# Altium schematic sheet BitDogLab V7.SchDoc: BitDogLab
size 420 x 297 mm; CompanyName: Escola 4.0 - Prof. Fruett; DrawnBy: Bruno Battistella; Revision: V7; SheetNumber: 1; SheetTotal: 1; SPICEModelCacheZKALFPLI: <root> / <DocumentId>ZKALFPLI</DocumentId> / </root>
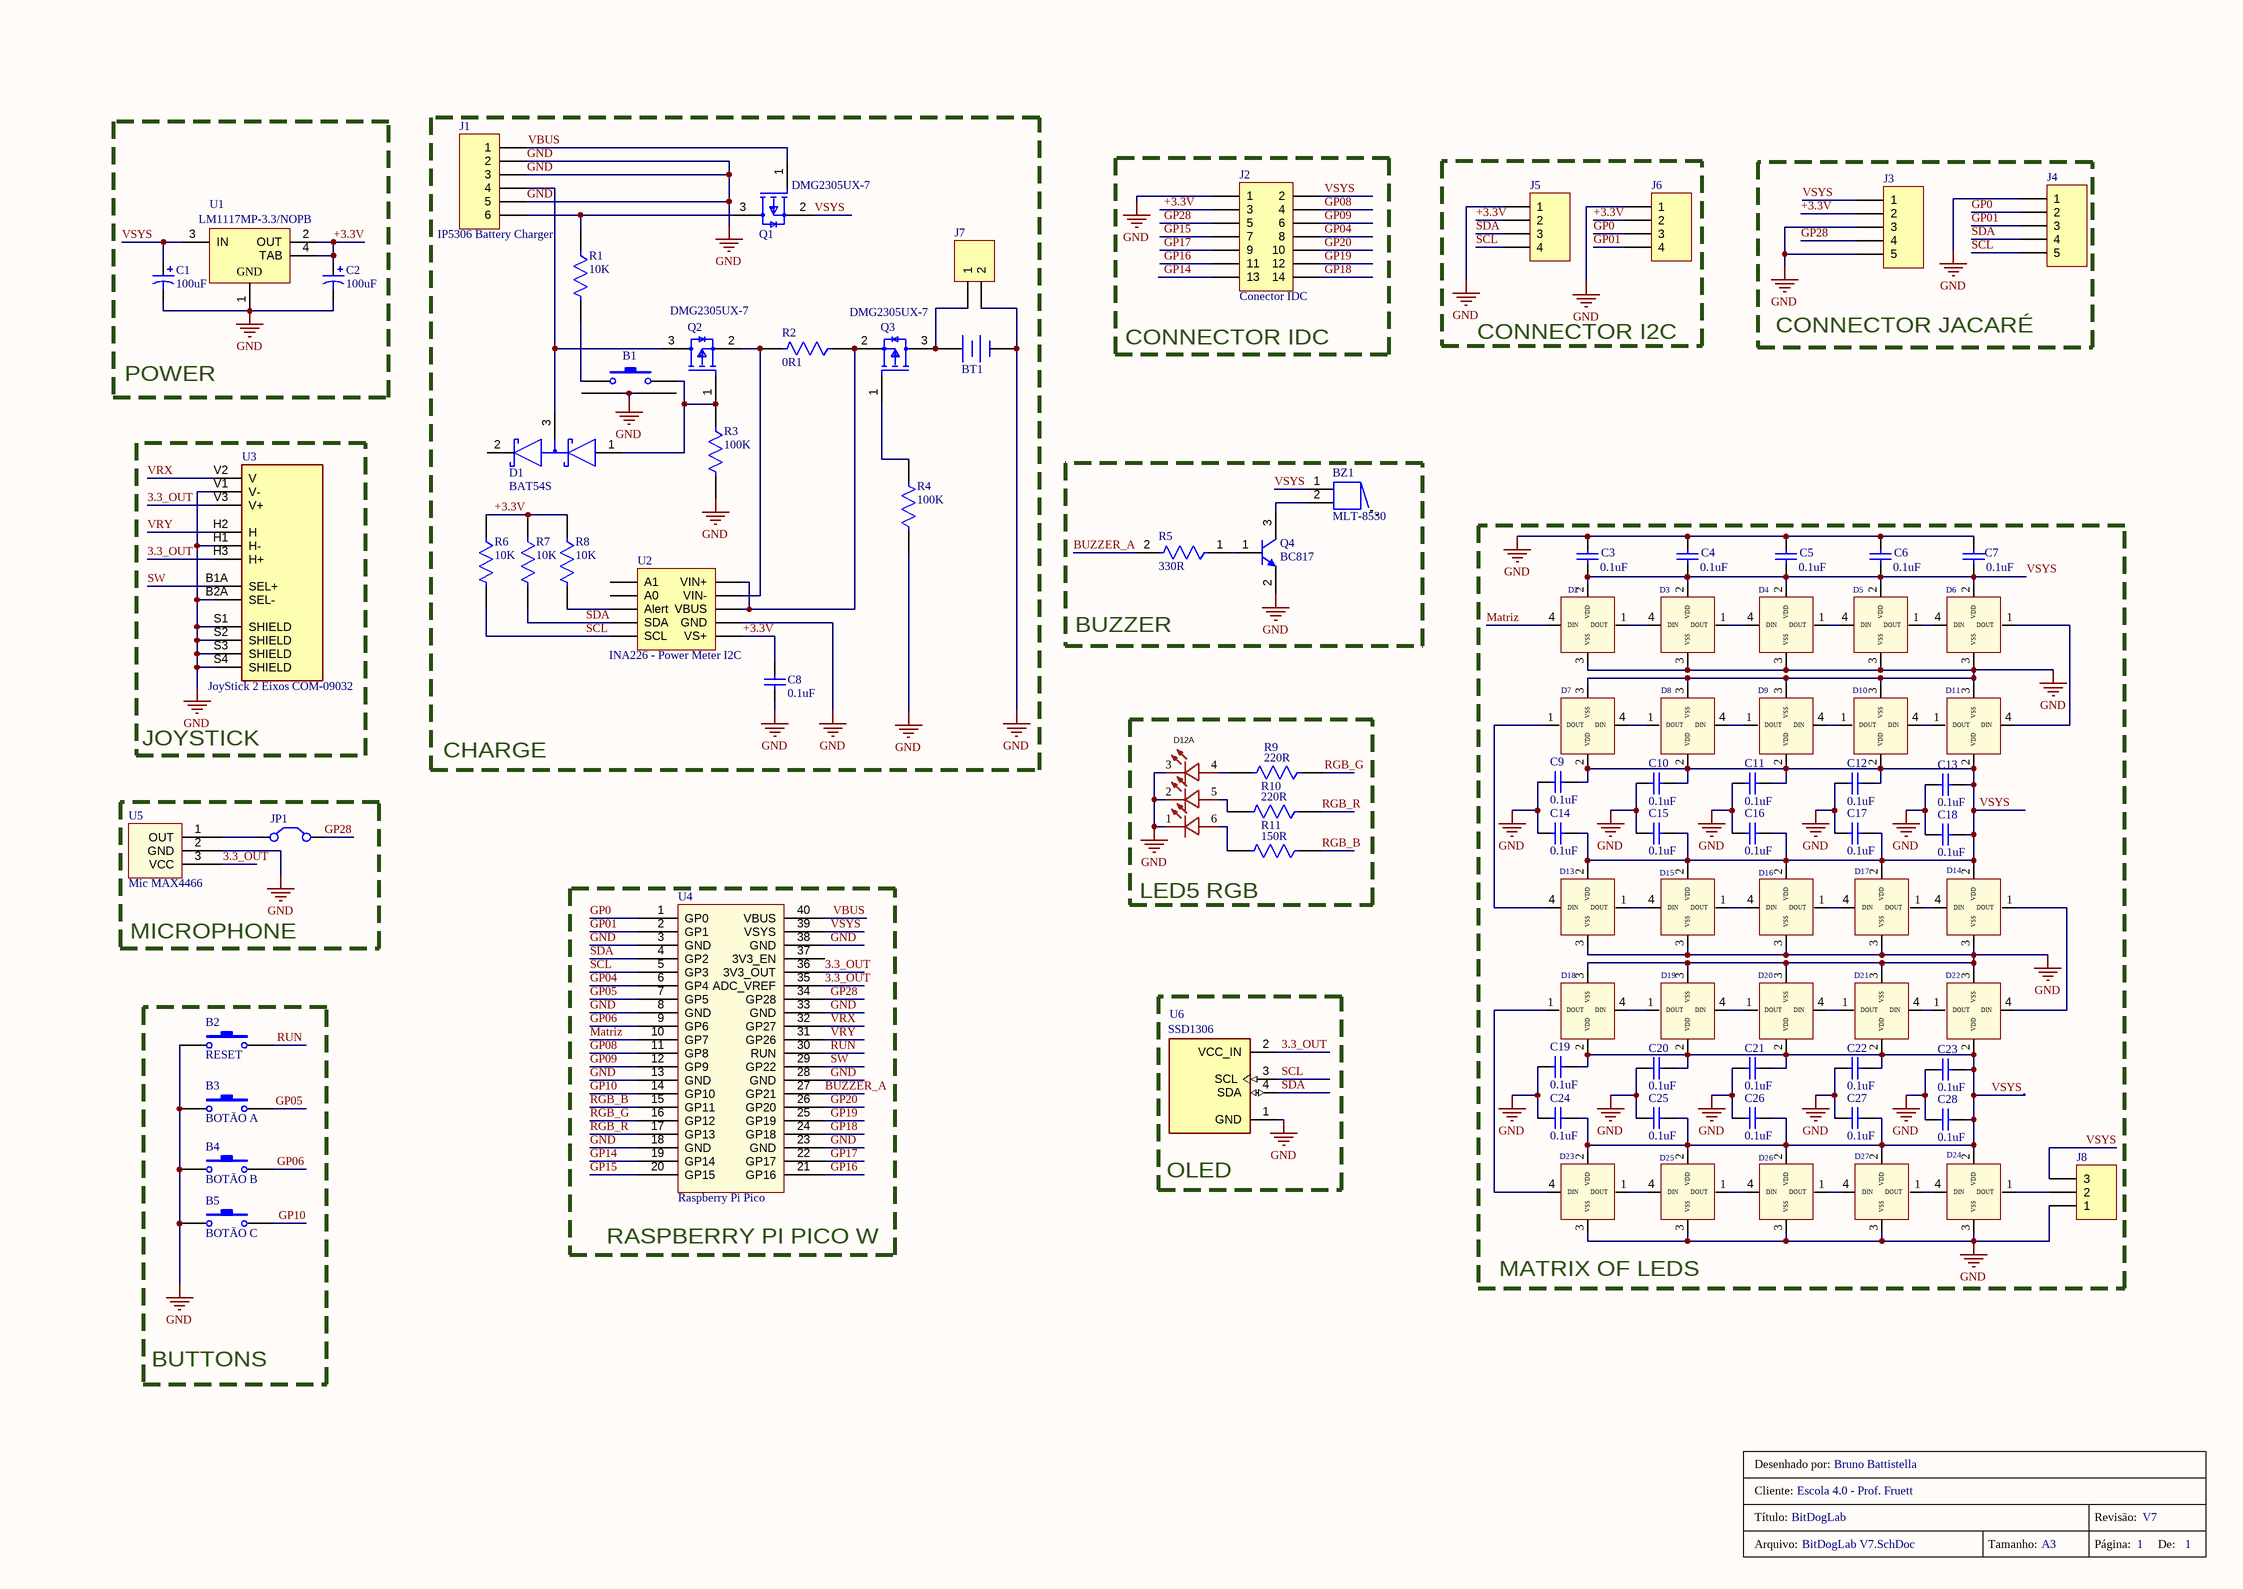
[diagram p0: BitDogLab V7.SchDoc]

## Parts
B1  Desliga  [CHAVE TÁCTIL SMD 90]  (value not drawn)
B2  RESET  [CHAVE TÁCTIL SMD]
B3  BOTÃO A  [CHAVE TÁCTIL 12mm - SMD]
B4  BOTÃO B  [CHAVE TÁCTIL 12mm - SMD]
B5  BOTÃO C  [CHAVE TÁCTIL 12mm - SMD]
BT1  FP-1043P-MFG  [Bateria 18650 - SMD]  (value not drawn)
BZ1  MLT-8530  [Buzzer SMD - MLT-8530]
C1  value 100uF  [Capacitor SMD - 6.3 x 5.4mm]  (hidden comment: Capacitor Eletrolítico SMD,D6.3xL5.4mm)
C2  value 100uF  [Capacitor SMD - 6.3 x 5.4mm]  (hidden comment: Capacitor Eletrolítico SMD,D6.3xL5.4mm)
C3  value 0.1uF  [Capacitor SMD 0402]  (hidden comment: Cap)
C4  value 0.1uF  [Capacitor SMD 0402]  (hidden comment: Cap)
C5  value 0.1uF  [Capacitor SMD 0402]  (hidden comment: Cap)
C6  value 0.1uF  [Capacitor SMD 0402]  (hidden comment: Cap)
C7  value 0.1uF  [Capacitor SMD 0402]  (hidden comment: Cap)
C8  value 0.1uF  [Capacitor SMD 0603]  (hidden comment: Cap)
C9  value 0.1uF  [Capacitor SMD 0402]  (hidden comment: Cap)
C10  value 0.1uF  [Capacitor SMD 0402]  (hidden comment: Cap)
C11  value 0.1uF  [Capacitor SMD 0402]  (hidden comment: Cap)
C12  value 0.1uF  [Capacitor SMD 0402]  (hidden comment: Cap)
C13  value 0.1uF  [Capacitor SMD 0402]  (hidden comment: Cap)
C14  value 0.1uF  [Capacitor SMD 0402]  (hidden comment: Cap)
C15  value 0.1uF  [Capacitor SMD 0402]  (hidden comment: Cap)
C16  value 0.1uF  [Capacitor SMD 0402]  (hidden comment: Cap)
C17  value 0.1uF  [Capacitor SMD 0402]  (hidden comment: Cap)
C18  value 0.1uF  [Capacitor SMD 0402]  (hidden comment: Cap)
C19  value 0.1uF  [Capacitor SMD 0402]  (hidden comment: Cap)
C20  value 0.1uF  [Capacitor SMD 0402]  (hidden comment: Cap)
C21  value 0.1uF  [Capacitor SMD 0402]  (hidden comment: Cap)
C22  value 0.1uF  [Capacitor SMD 0402]  (hidden comment: Cap)
C23  value 0.1uF  [Capacitor SMD 0402]  (hidden comment: Cap)
C24  value 0.1uF  [Capacitor SMD 0402]  (hidden comment: Cap)
C25  value 0.1uF  [Capacitor SMD 0402]  (hidden comment: Cap)
C26  value 0.1uF  [Capacitor SMD 0402]  (hidden comment: Cap)
C27  value 0.1uF  [Capacitor SMD 0402]  (hidden comment: Cap)
C28  value 0.1uF  [Capacitor SMD 0402]  (hidden comment: Cap)
D1  BAT54S  [FP-6_541-5014_01-4-MFG]
D2  XINGLIGHT XL-1615RGBC-WS2812B  [LED RGB - XL-1615RGBC-WS2812B]  (value not drawn)
D3  XINGLIGHT XL-1615RGBC-WS2812B  [LED RGB - XL-1615RGBC-WS2812B]  (value not drawn)
D4  XINGLIGHT XL-1615RGBC-WS2812B  [LED RGB - XL-1615RGBC-WS2812B]  (value not drawn)
D5  XINGLIGHT XL-1615RGBC-WS2812B  [LED RGB - XL-1615RGBC-WS2812B]  (value not drawn)
D6  XINGLIGHT XL-1615RGBC-WS2812B  [LED RGB - XL-1615RGBC-WS2812B]  (value not drawn)
D7  XINGLIGHT XL-1615RGBC-WS2812B  [LED RGB - XL-1615RGBC-WS2812B]  (value not drawn)
D8  XINGLIGHT XL-1615RGBC-WS2812B  [LED RGB - XL-1615RGBC-WS2812B]  (value not drawn)
D9  XINGLIGHT XL-1615RGBC-WS2812B  [LED RGB - XL-1615RGBC-WS2812B]  (value not drawn)
D10  XINGLIGHT XL-1615RGBC-WS2812B  [LED RGB - XL-1615RGBC-WS2812B]  (value not drawn)
D11  XINGLIGHT XL-1615RGBC-WS2812B  [LED RGB - XL-1615RGBC-WS2812B]  (value not drawn)
D12  HL-AF-5060H271BU46FU79GC-S1-THL  [LED RGB SMD 5050]  (value not drawn)  (part A of 3)
D13  XINGLIGHT XL-1615RGBC-WS2812B  [LED RGB - XL-1615RGBC-WS2812B]  (value not drawn)
D14  XINGLIGHT XL-1615RGBC-WS2812B  [LED RGB - XL-1615RGBC-WS2812B]  (value not drawn)
D15  XINGLIGHT XL-1615RGBC-WS2812B  [LED RGB - XL-1615RGBC-WS2812B]  (value not drawn)
D16  XINGLIGHT XL-1615RGBC-WS2812B  [LED RGB - XL-1615RGBC-WS2812B]  (value not drawn)
D17  XINGLIGHT XL-1615RGBC-WS2812B  [LED RGB - XL-1615RGBC-WS2812B]  (value not drawn)
D18  XINGLIGHT XL-1615RGBC-WS2812B  [LED RGB - XL-1615RGBC-WS2812B]  (value not drawn)
D19  XINGLIGHT XL-1615RGBC-WS2812B  [LED RGB - XL-1615RGBC-WS2812B]  (value not drawn)
D20  XINGLIGHT XL-1615RGBC-WS2812B  [LED RGB - XL-1615RGBC-WS2812B]  (value not drawn)
D21  XINGLIGHT XL-1615RGBC-WS2812B  [LED RGB - XL-1615RGBC-WS2812B]  (value not drawn)
D22  XINGLIGHT XL-1615RGBC-WS2812B  [LED RGB - XL-1615RGBC-WS2812B]  (value not drawn)
D23  XINGLIGHT XL-1615RGBC-WS2812B  [LED RGB - XL-1615RGBC-WS2812B]  (value not drawn)
D24  XINGLIGHT XL-1615RGBC-WS2812B  [LED RGB - XL-1615RGBC-WS2812B]  (value not drawn)
D25  XINGLIGHT XL-1615RGBC-WS2812B  [LED RGB - XL-1615RGBC-WS2812B]  (value not drawn)
D26  XINGLIGHT XL-1615RGBC-WS2812B  [LED RGB - XL-1615RGBC-WS2812B]  (value not drawn)
D27  XINGLIGHT XL-1615RGBC-WS2812B  [LED RGB - XL-1615RGBC-WS2812B]  (value not drawn)
J1  IP5306 Battery Charger  [Charger Module IP5306]
J2  Conector IDC  [Conector IDC 14 Pinos]
J3  Header 5  [HDR1X5]  (value not drawn)
J4  Header 5  [HDR1X5]  (value not drawn)
J5  Header 4  [Connector XH 1x4]  (value not drawn)
J6  Header 4  [Connector XH 1x4]  (value not drawn)
J7  KRE  [HDR1X2 3D Macho]  (value not drawn)
J8  Header 3  [HDR1x3 3D Macho]  (value not drawn)
JP1  Jumper  [HDR1x3 3D Macho]  (value not drawn)
Q1  DMG2305UX-7  [FP-SOT23-IPC_B]
Q2  DMG2305UX-7  [FP-SOT23-IPC_B]
Q3  DMG2305UX-7  [FP-SOT23-IPC_B]
Q4  BC817  [ONSC-SOT-23-3-318-08_V]
R1  10K  [FP-CRCW0603-e3-IPC_C]
R2  0R1  [FP-RL2512-MFG]
R3  100K  [FP-CRCW0603-e3-IPC_C]
R4  100K  [FP-CRCW0603-e3-IPC_C]
R5  330R  [FP-CRCW0603-e3-IPC_C]
R6  10K  [FP-CRCW0603-e3-IPC_C]
R7  10K  [FP-CRCW0603-e3-IPC_C]
R8  10K  [FP-CRCW0603-e3-IPC_C]
R9  220R  [FP-CRCW0603-e3-IPC_C]
R10  220R  [FP-CRCW0603-e3-IPC_C]
R11  150R  [FP-CRCW0603-e3-IPC_C]
U1  LM1117MP-3.3/NOPB  [DCY0004A_L]
U2  INA226 - Power Meter I2C  [MSOP 10 Pinos]
U3  JoyStick 2 Eixos COM-09032  [JoyStick PCB - PS5 3.0]
U4  Raspberry Pi Pico  [Raspberry Pi Pico W - Header SMD Tipo 1 e 2]
U5  Mic MAX4466  [MAX4466]
U6  SSD1306  [DISPLAY OLED 128x128 e 128x64]

## Blocks framed on the sheet
POWER: C1 C2 U1
CHARGE: B1 BT1 C8 D1 J1 J7 Q1-Q3 R1-R4 R6-R8 U2
CONNECTOR IDC: J2
CONNECTOR I2C: J5 J6
CONNECTOR JACARÉ: J3 J4
JOYSTICK: U3
BUZZER: BZ1 Q4 R5
MATRIX OF LEDS: C3-C7 C9-C28 D2-D11 D13-D27 J8
LED5 RGB: D12 R9-R11
MICROPHONE: JP1 U5
RASPBERRY PI PICO W: U4
BUTTONS: B2-B5
OLED: U6

## Nets
GND: B1.3 B1.4 B2.1 B3.1 B4.1 B5.1 BT1.1(-) C1.2 C2.2 C3.2 C4.2 C5.2 C6.2 C7.2 C8.2 C9.2 C10.2 C11.2 C12.2 C13.2 C14.2 C15.2 C16.2 C17.2 C18.2 C19.2 C20.2 C21.2 C22.2 C23.2 C24.2 C25.2 C26.2 C27.2 C28.2 D2.3(VSS) D3.3(VSS) D4.3(VSS) D5.3(VSS) D6.3(VSS) D7.3(VSS) D8.3(VSS) D9.3(VSS) D10.3(VSS) D11.3(VSS) D12.1 D12.2 D12.3 D13.3(VSS) D14.3(VSS) D15.3(VSS) D16.3(VSS) D17.3(VSS) D18.3(VSS) D19.3(VSS) D20.3(VSS) D21.3(VSS) D22.3(VSS) D23.3(VSS) D24.3(VSS) D25.3(VSS) D26.3(VSS) D27.3(VSS) J1.2 J1.3 J1.5 J2.1 J3.3 J3.5 J4.1 J5.1 J6.1 J7.2 J8.1 Q4.2(E) R3.2 R4.1 U1.1(GND) U2.7(GND) U3.B2A(SEL-) U3.H1(H-) U3.S1(SHIELD) U3.S2(SHIELD) U3.S3(SHIELD) U3.S4(SHIELD) U3.V1(V-) U4.3(GND) U4.8(GND) U4.13(GND) U4.18(GND) U4.23(GND) U4.28(GND) U4.33(GND) U4.38(GND) U5.2(GND) U6.1(GND)
3.3_OUT: U3.H3(H+) U3.V3(V+) U4.35(ADC_VREF) U4.36(3V3_OUT) U5.3(VCC) U6.2(VCC_IN)
+3.3V: C2.1 C8.1 J2.3 J3.2 J5.2 J6.2 R6.1 R7.1 R8.1 U1.2(OUT) U1.4(TAB) U2.6(VS+)
BUZZER_A: R5.2 U4.27(GP21)
GP0: J4.2 J6.3 U4.1(GP0)
GP01: J4.3 J6.4 U4.2(GP1)
GP04: J2.8 U4.6(GP4)
GP05: B3.2 U4.7(GP5)
GP06: B4.2 U4.9(GP6)
GP08: J2.4 U4.11(GP8)
GP09: J2.6 U4.12(GP9)
GP10: B5.2 U4.14(GP10)
GP14: J2.13 U4.19(GP14)
GP15: J2.7 U4.20(GP15)
GP16: J2.11 U4.21(GP16)
GP17: J2.9 U4.22(GP17)
GP18: J2.14 U4.24(GP18)
GP19: J2.12 U4.25(GP19)
GP20: J2.10 U4.26(GP20)
GP28: J2.5 J3.4 JP1.2(C2) U4.34(GP28)
Matriz: D2.4(DIN) U4.10(GP7)
RGB_B: R11.1 U4.15(GP11)
RGB_G: R9.1 U4.16(GP12)
RGB_R: R10.1 U4.17(GP13)
RUN: B2.2 U4.30(RUN)
SCL: J4.5 J5.4 R6.2 U2.5(SCL) U4.5(GP3) U6.3(SCL)
SDA: J4.4 J5.3 R7.2 U2.4(SDA) U4.4(GP2) U6.4(SDA)
SW: U3.B1A(SEL+) U4.29(GP22)
VBUS: J1.1 Q1.1(GATE) U4.40(VBUS)
VRX: U3.V2(V) U4.32(GP27)
VRY: U3.H2(H) U4.31(GP26)
VSYS: BZ1.1 C1.1 C3.1 C4.1 C5.1 C6.1 C7.1 C9.1 C10.1 C11.1 C12.1 C13.1 C14.1 C15.1 C16.1 C17.1 C18.1 C19.1 C20.1 C21.1 C22.1 C23.1 C24.1 C25.1 C26.1 C27.1 C28.1 D2.2(VDD) D3.2(VDD) D4.2(VDD) D5.2(VDD) D6.2(VDD) D7.2(VDD) D8.2(VDD) D9.2(VDD) D10.2(VDD) D11.2(VDD) D13.2(VDD) D14.2(VDD) D15.2(VDD) D16.2(VDD) D17.2(VDD) D18.2(VDD) D19.2(VDD) D20.2(VDD) D21.2(VDD) D22.2(VDD) D23.2(VDD) D24.2(VDD) D25.2(VDD) D26.2(VDD) D27.2(VDD) J2.2 J3.1 J8.3 Q1.2(SOURCE) U1.3(IN) U4.39(VSYS)
NetB1_1: B1.1 R1.2
NetB1_2: B1.2 D1.1 Q2.1(GATE) R3.1
NetBT1_2: BT1.2(+) J7.1 Q3.3(DRAIN)
NetBZ1_2: BZ1.2 Q4.3(C)
NetD1_3: D1.3 J1.4 Q2.3(DRAIN)
NetD2_1: D2.1(DOUT) D3.4(DIN)
NetD3_1: D3.1(DOUT) D4.4(DIN)
NetD4_1: D4.1(DOUT) D5.4(DIN)
NetD5_1: D5.1(DOUT) D6.4(DIN)
NetD6_1: D6.1(DOUT) D11.4(DIN)
NetD7_1: D7.1(DOUT) D13.4(DIN)
NetD7_4: D7.4(DIN) D8.1(DOUT)
NetD8_4: D8.4(DIN) D9.1(DOUT)
NetD9_4: D9.4(DIN) D10.1(DOUT)
NetD10_4: D10.4(DIN) D11.1(DOUT)
NetD12_4: D12.4 R9.2
NetD12_5: D12.5 R10.2
NetD12_6: D12.6 R11.2
NetD13_1: D13.1(DOUT) D15.4(DIN)
NetD14_1: D14.1(DOUT) D22.4(DIN)
NetD14_4: D14.4(DIN) D17.1(DOUT)
NetD15_1: D15.1(DOUT) D16.4(DIN)
NetD16_1: D16.1(DOUT) D17.4(DIN)
NetD18_1: D18.1(DOUT) D23.4(DIN)
NetD18_4: D18.4(DIN) D19.1(DOUT)
NetD19_4: D19.4(DIN) D20.1(DOUT)
NetD20_4: D20.4(DIN) D21.1(DOUT)
NetD21_4: D21.4(DIN) D22.1(DOUT)
NetD23_1: D23.1(DOUT) D25.4(DIN)
NetD24_1: D24.1(DOUT) J8.2
NetD24_4: D24.4(DIN) D27.1(DOUT)
NetD25_1: D25.1(DOUT) D26.4(DIN)
NetD26_1: D26.1(DOUT) D27.4(DIN)
NetJ1_6: J1.6 Q1.3(DRAIN) R1.1
NetJP1_1: JP1.1(C1) U5.1(OUT)
NetQ2_2: Q2.2(SOURCE) R2.2 U2.9(VIN-)
NetQ3_1: Q3.1(GATE) R4.2
NetQ3_2: Q3.2(SOURCE) R2.1 U2.8(VBUS) U2.10(VIN+)
NetQ4_1: Q4.1(B) R5.1
NetR8_2: R8.2 U2.3(Alert)

Not connected (* = marked no-connect by the designer): BZ1 3 4; D1 2; U2 1(A1) 2(A0); U4 37(3V3_EN)

## Notes on the sheet
- Desenhado por:
- Título:
- Cliente:
- Revisão:
- Arquivo:
- Tamanho:
- A3
- Página:
- De:

## Library data of the parts
B1 = Push Buttom SMD 90 graus: Botão Desliga Placa; Published: 24-Mar-1999; LatestRevisionDate: 17-Jul-2002; LatestRevisionNote: Re-released for DXP Platform.; PackageReference: SPST-2; Publisher: Altium Limited; LCSC Part Name: C393942
B2 = SW-PB: Botão Reset; Published: 24-Mar-1999; LatestRevisionDate: 17-Jul-2002; LatestRevisionNote: Re-released for DXP Platform.; PackageReference: SPST-2; Publisher: Altium Limited; LCSC Part Name: C7470150
B3-B5 = SW-PB: CHAVE TÁCTIL 12mm - SMD; Published: 24-Mar-1999; LatestRevisionDate: 17-Jul-2002; LatestRevisionNote: Re-released for DXP Platform.; PackageReference: SPST-2; Publisher: Altium Limited; LCSC Part Name: C455234
BT1 = Battery: Bateria 18650 3,7V; Published: 24-Mar-1999; LatestRevisionDate: 17-Jul-2002; LatestRevisionNote: Re-released for DXP Platform.; PackageReference: BAT-2; Publisher: Altium Limited
BZ1 = Buzzer: Buzzer SMD; Published: 24-Mar-1999; LatestRevisionDate: 17-Dec-2003; LatestRevisionNote: Schematic revised, PCB Footprint replaced.; DatasheetVersion: 17-Dec-2003; PackageReference: ABSM-1574; Publisher: Altium Limited; ComponentLink1Description: Manufacturer Link; ComponentLink1URL: https://www.lcsc.com/product-detail/Buzzers_Jiangsu-Huaneng-Elec-MLT-8530_C94599.html; LCSC Part Name: C94599
C1 C2 = Cap Pol1: Capacitor Eletrolítico 100uF  SMD 6.3 x 5.4 mm; Published: 8-Jun-2000; LatestRevisionDate: 17-Jul-2002; LatestRevisionNote: Re-released for DXP Platform.; PackageReference: RB7.6-15; Publisher: Altium Limited; LCSC Part Name: C7469977
C3-C28 = Cap: Capacitor SMD 0402; Published: 8-Jun-2000; LatestRevisionDate: 17-Jul-2002; LatestRevisionNote: Re-released for DXP Platform.; PackageReference: RAD-0.3; Publisher: Altium Limited
  C3-C7 C9-C28: LCSC Part Name: C105883
  C8: LCSC Part Name: C30926
D1 = CMP-02539-000028-1: Diodo Schottky SOT23; Manufacturer Part Number: BAT54S-E3-08; Manufacturer: Vishay; Max Repetitive Reverse Voltage: 30V; Capacitance: 10pF; Forward Current: 200mA; Max Junction Temp: +125°C; Value: 10pF; Max Surge Forward Current: 600mA; Peak Reverse Current: 2uA; Temperature: -55°C to +125°C; Device Class L1: Discrete Semiconductors; Height: 1.15mm; ComponentLink2Description: Datasheet; Mouser Description: Schottky Diodes & Rectifiers 200mA 30 Volt; Package: 6.541-5014.01-4; Temperature Range High: +125°C; Digikey Description: DIODE ARRAY SCHOTTKY 30V SOT23; Device Class L2: Diodes; ComponentLink2URL: http://www.vishay.com/docs/85508/bat54.pdf; RoHS: TRUE; Octopart: https://octopart.com/bat54s-e3-08-vishay-29186616; Automotive: No; Lead Free: Yes; Category: Diode; Temperature Range Low: -55°C; Device Class L3: Schottky Diodes; LCSC Part Name: C47546
D2-D11 D13-D27 = LED RGB XL-1615RGBC-WS2812B: LED RGB Endereçável; LCSC Part Name: C5349954
D12 = LED_RGB_5050 - HL-AF-5060H271BU46FU79GC-S1-THL: LED RGB 5050; Manufacturer: HONGLITRONIC(鸿利光电); Add into BOM: yes; Symbol: HL-AF-5060H271BU46FU79GC-S1-THL; Device: HL-AF-5060H271BU46FU79GC-S1-THL; LCSC Part Name: C2843868; Supplier Part: C2843868; Manufacturer Part: HL-AF-5060H271BU46FU79GC-S1-THL; Supplier Footprint: SMD5050; JLCPCB Part Class: Extended Part; Datasheet: https://atta.szlcsc.com/upload/public/pdf/source/20180503/C219409_0CFE42153F672A4C05B1C40D14E85291.pdf; Supplier: LCSC; Convert to PCB: yes
J1 = Header 6: Múdulo de Carga Bateria; LatestRevisionDate: 17-Jul-2002; LatestRevisionNote: Re-released for DXP Platform.; Publisher: Altium Limited
J2 = Header 7X2: Conector IDC 14 Pinos SMT; LatestRevisionDate: 17-Jul-2002; LatestRevisionNote: Re-released for DXP Platform.; Publisher: Altium Limited; LCSC Part Name: C601968
J3 J4 = Header 5: Saídas de Expansão; LatestRevisionDate: 17-Jul-2002; LatestRevisionNote: Re-released for DXP Platform.; Publisher: Altium Limited
J5 J6 = Header 4: Header, 4-Pin; LatestRevisionDate: 17-Jul-2002; LatestRevisionNote: Re-released for DXP Platform.; Publisher: Altium Limited
J7 = Header 2: Entrada Bateria Externa; LatestRevisionDate: 17-Jul-2002; LatestRevisionNote: Re-released for DXP Platform.; Publisher: Altium Limited
J8 = Header 3: Saída LED Endereçáveis; LatestRevisionDate: 17-Jul-2002; LatestRevisionNote: Re-released for DXP Platform.; Publisher: Altium Limited
JP1 = Jumper: Liga Microfone; Published: 24-Mar-1999; LatestRevisionDate: 17-Jul-2002; LatestRevisionNote: Re-released for DXP Platform.; PackageReference: RAD-0.2; Publisher: Altium Limited
Q1-Q3 = CMP-1693-00002-4: MOSFET P-CH 20V 4.2A SOT23; Turn-On Delay Time: 10.8ns; Turn-Off Delay Time: 79.3ns; Threshold Voltage: -900mV; Rise Time: 13.7ns; Gate to Source Voltage (Vgs): 8V; Rds On Max: 52mR; Element Configuration: Single; Fall Time: 34.7ns; Max Power Dissipation: 1.4W; Drain to Source Resistance: 200mR; Number of Channels: 1; Input Capacitance: 808pF; Lead Free: Lead Free; Number of Pins: 3; Length: 3mm; Continuous Drain Current (ID): 4.2A; Contact Plating: Tin; Mount: Surface Mount; Weight: 0.000282oz; Min Operating Temperature: -55°C; Package Quantity: 3000; Drain to Source Voltage (Vdss): 20V; On-State Resistance: 52MR; Max Operating Temperature: 150°C; Height: 1.1mm; REACH SVHC: No SVHC; Packaging: Tape and Reel; Radiation Hardening: No; Case/Package: SOT-23; Width: 1.4mm; LCSC Part Name: C150470
Q4 = CMP-1048-00736-1: General Purpose Transistor, NPN Silicon, 3-Pin SOT-23, Pb-Free, Tape and Reel; PartNumber: BC817-16LT1G; Manufacturer: On Semiconductor; IC Continuous (A): 0.5; fT Min (MHz): 100; Mounting Technology: Surface Mount; PackageVersion: Rev. AP, 11/2009; ComponentLink3Description: Package Specification; PackageReference: SOT-23-3-318-08; Packing: Tape and Reel; ComponentLink1URL: http://www.onsemi.com/; Polarity: NPN; RoHS: TRUE; ComponentLink2URL: http://www.onsemi.com/pub_link/Collateral/BC817-16LT1-D.PDF; ComponentLink3URL: http://www.onsemi.cn/pub_link/Collateral/318-08.PDF; ComponentLink2Description: Datasheet; PackageDescription: 3-Pin Small Outline Transistor, Body 2.92 x 1.3 mm, Pitch 0.95 mm; ComponentLink1Description: Manufacturer URL; DatasheetVersion: Rev. 12; LCSC Part Name: C52801
R1 = CMP-2000-03059-2: RES Thick Film, 10kΩ, 1%, 0.1W, 100ppm/°C, 0603; Resistance: 10kR; Voltage Rating (DC): 75V; Power Rating: 100mW; Termination: SMD/SMT; Depth: 0.85mm; Military Standard: Not; Case Code (Metric): 1608; Composition: Thick Film; Package Quantity: 10; Width: 0.033inch; Voltage Rating: 75V; Features: Automotive AEC-Q200; Max Power Dissipation: 100mW; Height: 0.45mm; Mount: Surface Mount; Max Operating Temperature: 155°C; Weight: 7.1E-05oz; Lead Free: Lead Free; Length: 1.55mm; Radiation Hardening: No; Case/Package: 0603; Packaging: Tape and Reel; Contact Plating: Tin; Min Operating Temperature: -55°C; Working Voltage: 75V; Temperature Coefficient: 100ppm/°C; Case Code (Imperial): 0603; Tolerance: 1%; Number of Terminations: 2; LCSC Part Name: C98220
R2 = CMP-03412-013102-1: RES 0.1 OHM 1% 1W 2512; Manufacturer: YAGEO; Manufacturer Part Number: RL2512FK-070R1L; Automotive Grade: Grade 0; Temperature Coefficient: 600ppm/°C; Value: 100mΩ; Lead Free: Yes; Package: RL2512; Temperature Range High: +155°C; Octopart: https://octopart.com/rl2512fk-070r1l-yageo-42334369; Composition: Thick Film; Height: 0.65mm; ComponentLink2URL: http://www.yageo.com/documents/recent/PYu-RL_Group_521_RoHS_L_2.pdf; Device Class L3: Chip SMD Resistors; Automotive: Yes; Series: RL; Device Class L1: Passive Components; Device Class L2: Resistors; Mouser Description: Current Sense Resistors 0.1ohm 1% 1W; Temperature: -55°C to +155°C; ComponentLink2Description: Datasheet; Footprint Url: http://www.yageo.com/exep/pages/download/literatures/PYu-R_Mount_10.pdf; Ipc Land Pattern Name: RESC635320X55; RoHS: TRUE; Category: Res; Temperature Range Low: -55°C; Power Rating: 1W; Tolerance: 1%; Resistance: 100mΩ; Digikey Description: RES 0.1 OHM 1% 1W 2512; LCSC Part Name: C160587
R3 R4 = CMP-2000-03059-2: RES Thick Film, 100kΩ, 1%, 0.1W, 100ppm/°C, 0603; Resistance: 100kR; Voltage Rating (DC): 75V; Power Rating: 100mW; Termination: SMD/SMT; Depth: 0.85mm; Military Standard: Not; Case Code (Metric): 1608; Composition: Thick Film; Package Quantity: 10; Width: 0.033inch; Voltage Rating: 75V; Features: Automotive AEC-Q200; Max Power Dissipation: 100mW; Height: 0.45mm; Mount: Surface Mount; Max Operating Temperature: 155°C; Weight: 7.1E-05oz; Lead Free: Lead Free; Length: 1.55mm; Radiation Hardening: No; Case/Package: 0603; Packaging: Tape and Reel; Contact Plating: Tin; Min Operating Temperature: -55°C; Working Voltage: 75V; Temperature Coefficient: 100ppm/°C; Case Code (Imperial): 0603; Tolerance: 1%; Number of Terminations: 2; LCSC Part Name: C25803
R5 = CMP-2000-03059-2: RES Thick Film, 330Ω, 1%, 0.1W, 100ppm/°C, 0603; Voltage Rating (DC): 75V; Power Rating: 100mW; Resistance: 330R; Termination: SMD/SMT; Depth: 0.85mm; Military Standard: Not; Case Code (Metric): 1608; Composition: Thick Film; Package Quantity: 10; Width: 0.033inch; Voltage Rating: 75V; Features: Automotive AEC-Q200; Max Power Dissipation: 100mW; Height: 0.45mm; Mount: Surface Mount; Max Operating Temperature: 155°C; Weight: 7.1E-05oz; Lead Free: Lead Free; Length: 1.55mm; Radiation Hardening: No; Case/Package: 0603; Packaging: Tape and Reel; Contact Plating: Tin; Min Operating Temperature: -55°C; Working Voltage: 75V; Temperature Coefficient: 100ppm/°C; Case Code (Imperial): 0603; Tolerance: 1%; Number of Terminations: 2; LCSC Part Name: C23138
R6-R8 = CMP-2000-03059-2: RES Thick Film, 10kΩ, 1%, 0.1W, 100ppm/°C, 0603; Voltage Rating (DC): 75V; Power Rating: 100mW; Resistance: 10k; Termination: SMD/SMT; Depth: 0.85mm; Military Standard: Not; Case Code (Metric): 1608; Composition: Thick Film; Package Quantity: 10; Width: 0.033inch; Voltage Rating: 75V; Features: Automotive AEC-Q200; Max Power Dissipation: 100mW; Height: 0.45mm; Mount: Surface Mount; Max Operating Temperature: 155°C; Weight: 7.1E-05oz; Lead Free: Lead Free; Length: 1.55mm; Radiation Hardening: No; Case/Package: 0603; Packaging: Tape and Reel; Contact Plating: Tin; Min Operating Temperature: -55°C; Working Voltage: 75V; Temperature Coefficient: 100ppm/°C; Case Code (Imperial): 0603; Tolerance: 1%; Number of Terminations: 2; LCSC Part Name: C98220
R9 R10 = CMP-2000-03059-2: RES Thick Film, 220Ω, 1%, 0.1W, 100ppm/°C, 0603; Voltage Rating (DC): 75V; Power Rating: 100mW; Resistance: 220R; Termination: SMD/SMT; Depth: 0.85mm; Military Standard: Not; Case Code (Metric): 1608; Composition: Thick Film; Package Quantity: 10; Width: 0.033inch; Voltage Rating: 75V; Features: Automotive AEC-Q200; Max Power Dissipation: 100mW; Height: 0.45mm; Mount: Surface Mount; Max Operating Temperature: 155°C; Weight: 7.1E-05oz; Lead Free: Lead Free; Length: 1.55mm; Radiation Hardening: No; Case/Package: 0603; Packaging: Tape and Reel; Contact Plating: Tin; Min Operating Temperature: -55°C; Working Voltage: 75V; Temperature Coefficient: 100ppm/°C; Case Code (Imperial): 0603; Tolerance: 1%; Number of Terminations: 2; LCSC Part Name: C2907014
R11 = CMP-2000-03059-2: RES Thick Film, 150Ω, 1%, 0.1W, 100ppm/°C, 0603; Voltage Rating (DC): 75V; Power Rating: 100mW; Resistance: 150R; Termination: SMD/SMT; Depth: 0.85mm; Military Standard: Not; Case Code (Metric): 1608; Composition: Thick Film; Package Quantity: 10; Width: 0.033inch; Voltage Rating: 75V; Features: Automotive AEC-Q200; Max Power Dissipation: 100mW; Height: 0.45mm; Mount: Surface Mount; Max Operating Temperature: 155°C; Weight: 7.1E-05oz; Lead Free: Lead Free; Length: 1.55mm; Radiation Hardening: No; Case/Package: 0603; Packaging: Tape and Reel; Contact Plating: Tin; Min Operating Temperature: -55°C; Working Voltage: 75V; Temperature Coefficient: 100ppm/°C; Case Code (Imperial): 0603; Tolerance: 1%; Number of Terminations: 2; LCSC Part Name: C2907103
U1 = CMP-0062-01638-4: 800mA Low-Dropout Linear Regulator, 4-pin SOT-223, Pb-Free; Manufacturer: Texas Instruments; CompType: LDO IC; PackageTopMarking: XYTT*N05A; High-Reliability: Y; PowerWise: N; ComponentLink1URL: http://www.ti.com/general/docs/lit/getliterature.tsp?genericPartNumber=LM1117-N&fileType=pdf; PinCount: 4; PackageDescription: Molded SOT-223, 6.50 x 3.56 x 1.6mm Body, 4 Lead, 2.3mm Pitch; Code_IPC: SOT223-4; PartNumber: LM1117MP-3.3/NOPB; Code_JEDEC: TO-261-AA; RoHS: Y; PackageReference: DCY0004A; ComponentLink1Description: Datasheet URL; LCSC Part Name: C9662
U2 = INA226: Ultra-Precise I2C Output Current, Voltage, and Power Monitor; LatestRevisionDate: 17-Jul-2002; LatestRevisionNote: Re-released for DXP Platform.; Publisher: Altium Limited; LCSC Part Name: C49851
U3 = JoyStick COM-09032: Joystick Analógico (Resistivo e de Efeito Hall)
U4 = Raspberry Pi Pico W: RP2040 Raspberry Pi Pico - ARMÂ® CortexÂ®-M0+ MCU 32-Bit Embedded Evaluation Board; MP: SC0918; MF: Raspberry Pi; Package: None; Price: None; Check_prices: https://www.snapeda.com/parts/SC0918/Raspberry+Pi/view-part/?ref=eda; Value: *; SnapEDA_Link: https://www.snapeda.com/parts/SC0918/Raspberry+Pi/view-part/?ref=snap; Availability: In Stock; Purchase-URL: https://pricing.snapeda.com/search/part/SC0918/?ref=eda
U5 = MAX4466 - Módulo Microfone: Módulo de Microfone
U6 = SSD1306 - DISPLAY OLED: 0.96" 128 X 64 MONOCHROME GRAPHIC OLED DISPLAY MODULE - I2C; MP: DM-OLED096-636; SnapEDA_Link: https://www.snapeda.com/parts/DM-OLED096-636/Display+Module/view-part/?ref=snap; Package: Package; Value: *; MF: Display Module; Check_prices: https://www.snapeda.com/parts/DM-OLED096-636/Display+Module/view-part/?ref=eda